# EAGLE design EVsimv2 (EAGLE 6.5.0)
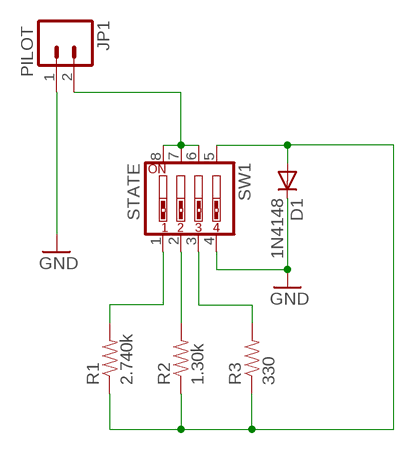
[diagram p0: schematic, sheet 1]

## Parts
D1  1N4148  DIODE1N4148  [DIODE-1N4148]
JP1  PILOT  M023.5MM_LOCK  [SCREWTERMINAL-3.5MM-2_LOCK]
R1  2.740k  RESISTORPTH-1/4W  [AXIAL-0.4]
R2  1.30k  RESISTORPTH-1/4W  [AXIAL-0.4]
R3  330  RESISTORPTH-1/4W  [AXIAL-0.4]
SW1  STATE  SW_DIP-4  [EDG-04]

## Nets
GND: D1.C JP1.1 SW1.4
N$1: D1.A R1.P$1 R2.P$1 R3.P$1 SW1.5
N$2: JP1.2 SW1.6 SW1.7 SW1.8
N$3: R1.P$2 SW1.1
N$4: R2.P$2 SW1.2
N$5: R3.P$2 SW1.3

## Library data of the parts
D1 = SparkFun:DIODE: Diode These are standard reverse protection diodes and small signal diodes. SMA package can handle up to about 1A. SOD-323 can handle about 200mA. What the SOD-323 package when ordering, there are some mfgs out there that are 5-pin packages.
JP1 = SparkFun:M02: Header 2 Standard 2-pin 0.1" header. Use with straight break away headers (SKU : PRT-00116), right angle break away headers (PRT-00553), swiss pins (PRT-00743), machine pins (PRT-00117), and female headers (PRT-00115). Molex polarized connector foot print use with SKU : PRT-08233 with associated crimp pins and housings.
R1-R3 = SparkFun:RESISTOR: Resistor Basic schematic elements and footprints for 0603, 1206, and PTH resistors.
SW1 = special:SW_DIP-4: DIP SWITCH

## Board
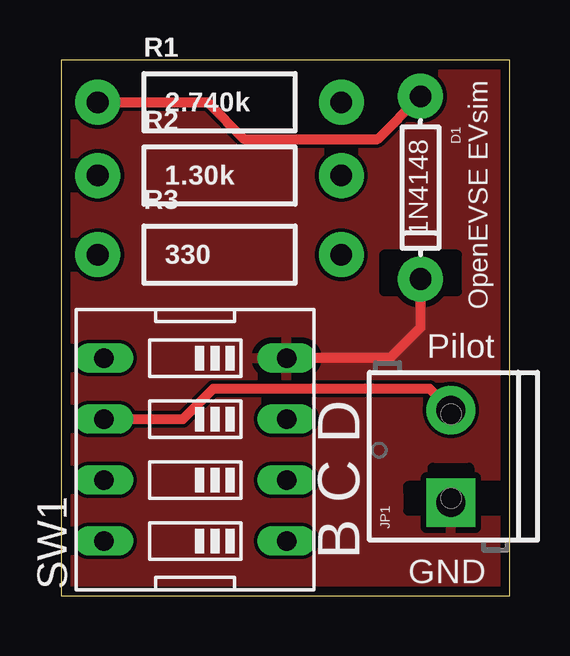
[diagram p1: board, top side]
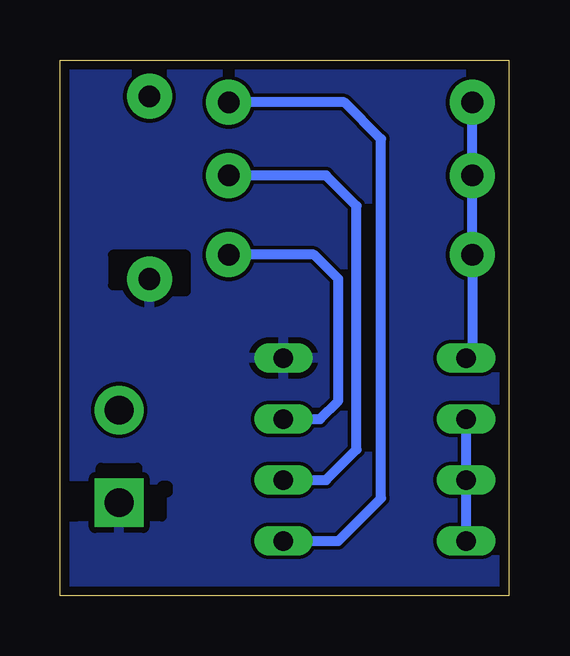
[diagram p2: board, bottom side, seen from below]

Size 18.72 x 22.34 mm. Coordinates in mm from the lower left corner, seen from the top.
Outline: 0,0 18.72,0 18.72,22.34 0,22.34 0,0
Copper layers (1*16): Top 0.0356mm / dielectric 1.5011mm / Bottom 0.0356mm
Design rules: minimum track width 6mil, minimum drill 13mil, track to track 6mil, track to pad 6mil, pad to pad 6mil, via to via 6mil, smd to smd 6mil, copper to edge 15mil, drill to drill 6mil, minimum pad ring 7mil, minimum via ring 7mil, stop-mask expansion 4mil, vias tented up to drill 0mil, thermal gap 10mil
tRestrict: area 14.5,3.6 to 18,4.6; area 15.5,4.3 to 17,5.3; area 13.5,12.7 to 16.5,14.2
bRestrict: area 14.2,3.3 to 18,5.3; area 13.5,12.7 to 16.5,14.2

### Footprints (pad centres in the part's own frame; a part is rotated, then mirrored left to right if it is on the bottom)
DIODE-1N4148 = drill 0.9 pad 1.88: A -3.81,0; C 3.81,0
SCREWTERMINAL-3.5MM-2_LOCK = drill 1.2 pad 2.032 square: 1 -0.178,0 | drill 1.2 pad 2.032: 2 3.678,0
AXIAL-0.4 = drill 0.9 pad 1.88: P$1 -5.08,0; P$2 5.08,0
EDG-04 = drill 0.813 long: 1 -3.81,-3.81; 2 -1.27,-3.81; 3 1.27,-3.81; 4 3.81,-3.81; 5 3.81,3.81; 6 1.27,3.81; 7 -1.27,3.81; 8 -3.81,3.81

### Placement (x,y rotation side)
D1  14.99,17.02 270 top
JP1  16.26,4.06 90 top
R1  6.6,20.57 0 top
R2  6.6,17.53 0 top
R3  6.6,14.22 0 top
SW1  5.59,6.1 90 top

### Tracks (layer width: path | path; a pad name or v marks a point on that pad's centre or on a via)
GND
  Top 0.406: D1.C 14.99,11.18 13.72,9.91 SW1.4
  pour Top: -3.81,27.43 22.86,27.43 22.86,-3.05 -3.81,-3.05
  pour Bottom: -5.08,29.97 25.4,29.97 25.4,-5.59 -5.08,-5.59
N$1
  Top 0.406: R1.P$1 6.1,20.57 7.62,19.05 13.21,19.05 D1.A
  Bottom 0.406: R1.P$1 R2.P$1 R3.P$1 1.52,10.16 SW1.5
N$2
  Top 0.406: SW1.6 5.08,7.37 6.35,8.64 15.36,8.64 JP1.2
  Bottom 0.406: SW1.8 SW1.7 SW1.6
N$3
  Bottom 0.406: SW1.1 7.11,2.29 5.33,4.06 5.33,19.05 6.86,20.57 R1.P$2
N$4
  Bottom 0.406: SW1.2 7.62,4.83 6.35,6.1 6.35,16.26 7.62,17.53 R2.P$2
N$5
  Bottom 0.406: SW1.3 7.87,7.37 7.11,8.13 7.11,13.21 8.13,14.22 R3.P$2

### Text on the board
tNames: OpenEVSE EVsim | Pilot | B C D | GND